# Altium schematic sheet BatteryCheck.SchDoc
size 420 x 297 mm; DocumentNumber: BatteryCheck
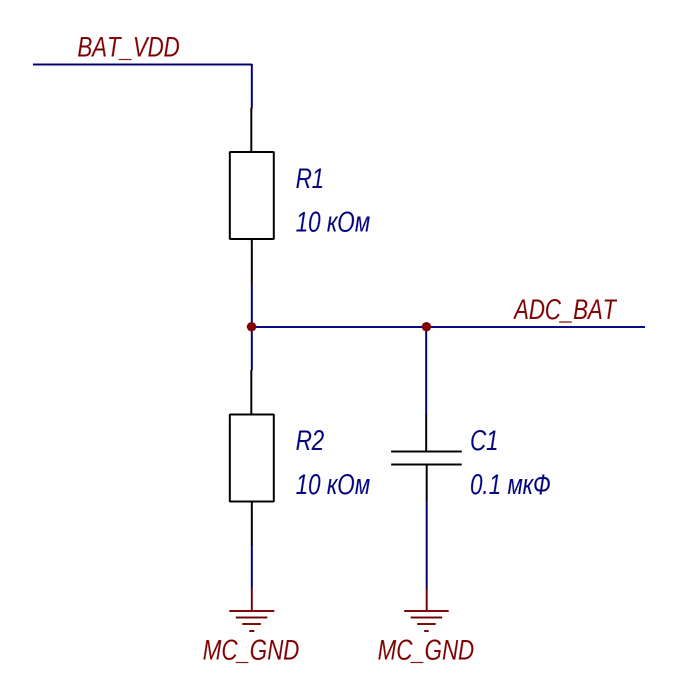
[diagram p0: BatteryCheck.SchDoc]

## Parts
C1  0.1 мкФ  [C 0805]
R1  10 кОм  [RES 0402]
R2  10 кОм  [RES 0402]

## Nets
MC_GND: C1.2 R2.1
ADC_BAT: C1.1 R1.1 R2.2
BAT_VDD: R1.2

## Notes on the sheet
- Подп. и дата
- Инв. № дубл.
- Взам. инв. №
- Инв. № подл.
- Лист
- Изм.
- № докум.
- Подп.
- Дата
- Копировал
- Формат А3

## Library data of the parts
C1 = CAP 0805: SMD Capacitor 0805; Manufacturer: /Укажите компанию-производителя/; Tolerance: /Укажите допуск в процентах/; Temperature coefficient: /Формат: ±? ppm/°C/; Type: Конденсатор керамический; TC: /Укажите тип диэлектрика/; Size: 0805; Temperature range: /Формат: -? ... ? °C/
R1 R2 = RES 0402